# EasyEDA schematic 1-Schematic_Self-balancing robot V2.0.json
TITLE: New Schematic; REV: 1.0; Date: 2018-07-19; Sheet: 1/1; Drawn By: TheShowiest7
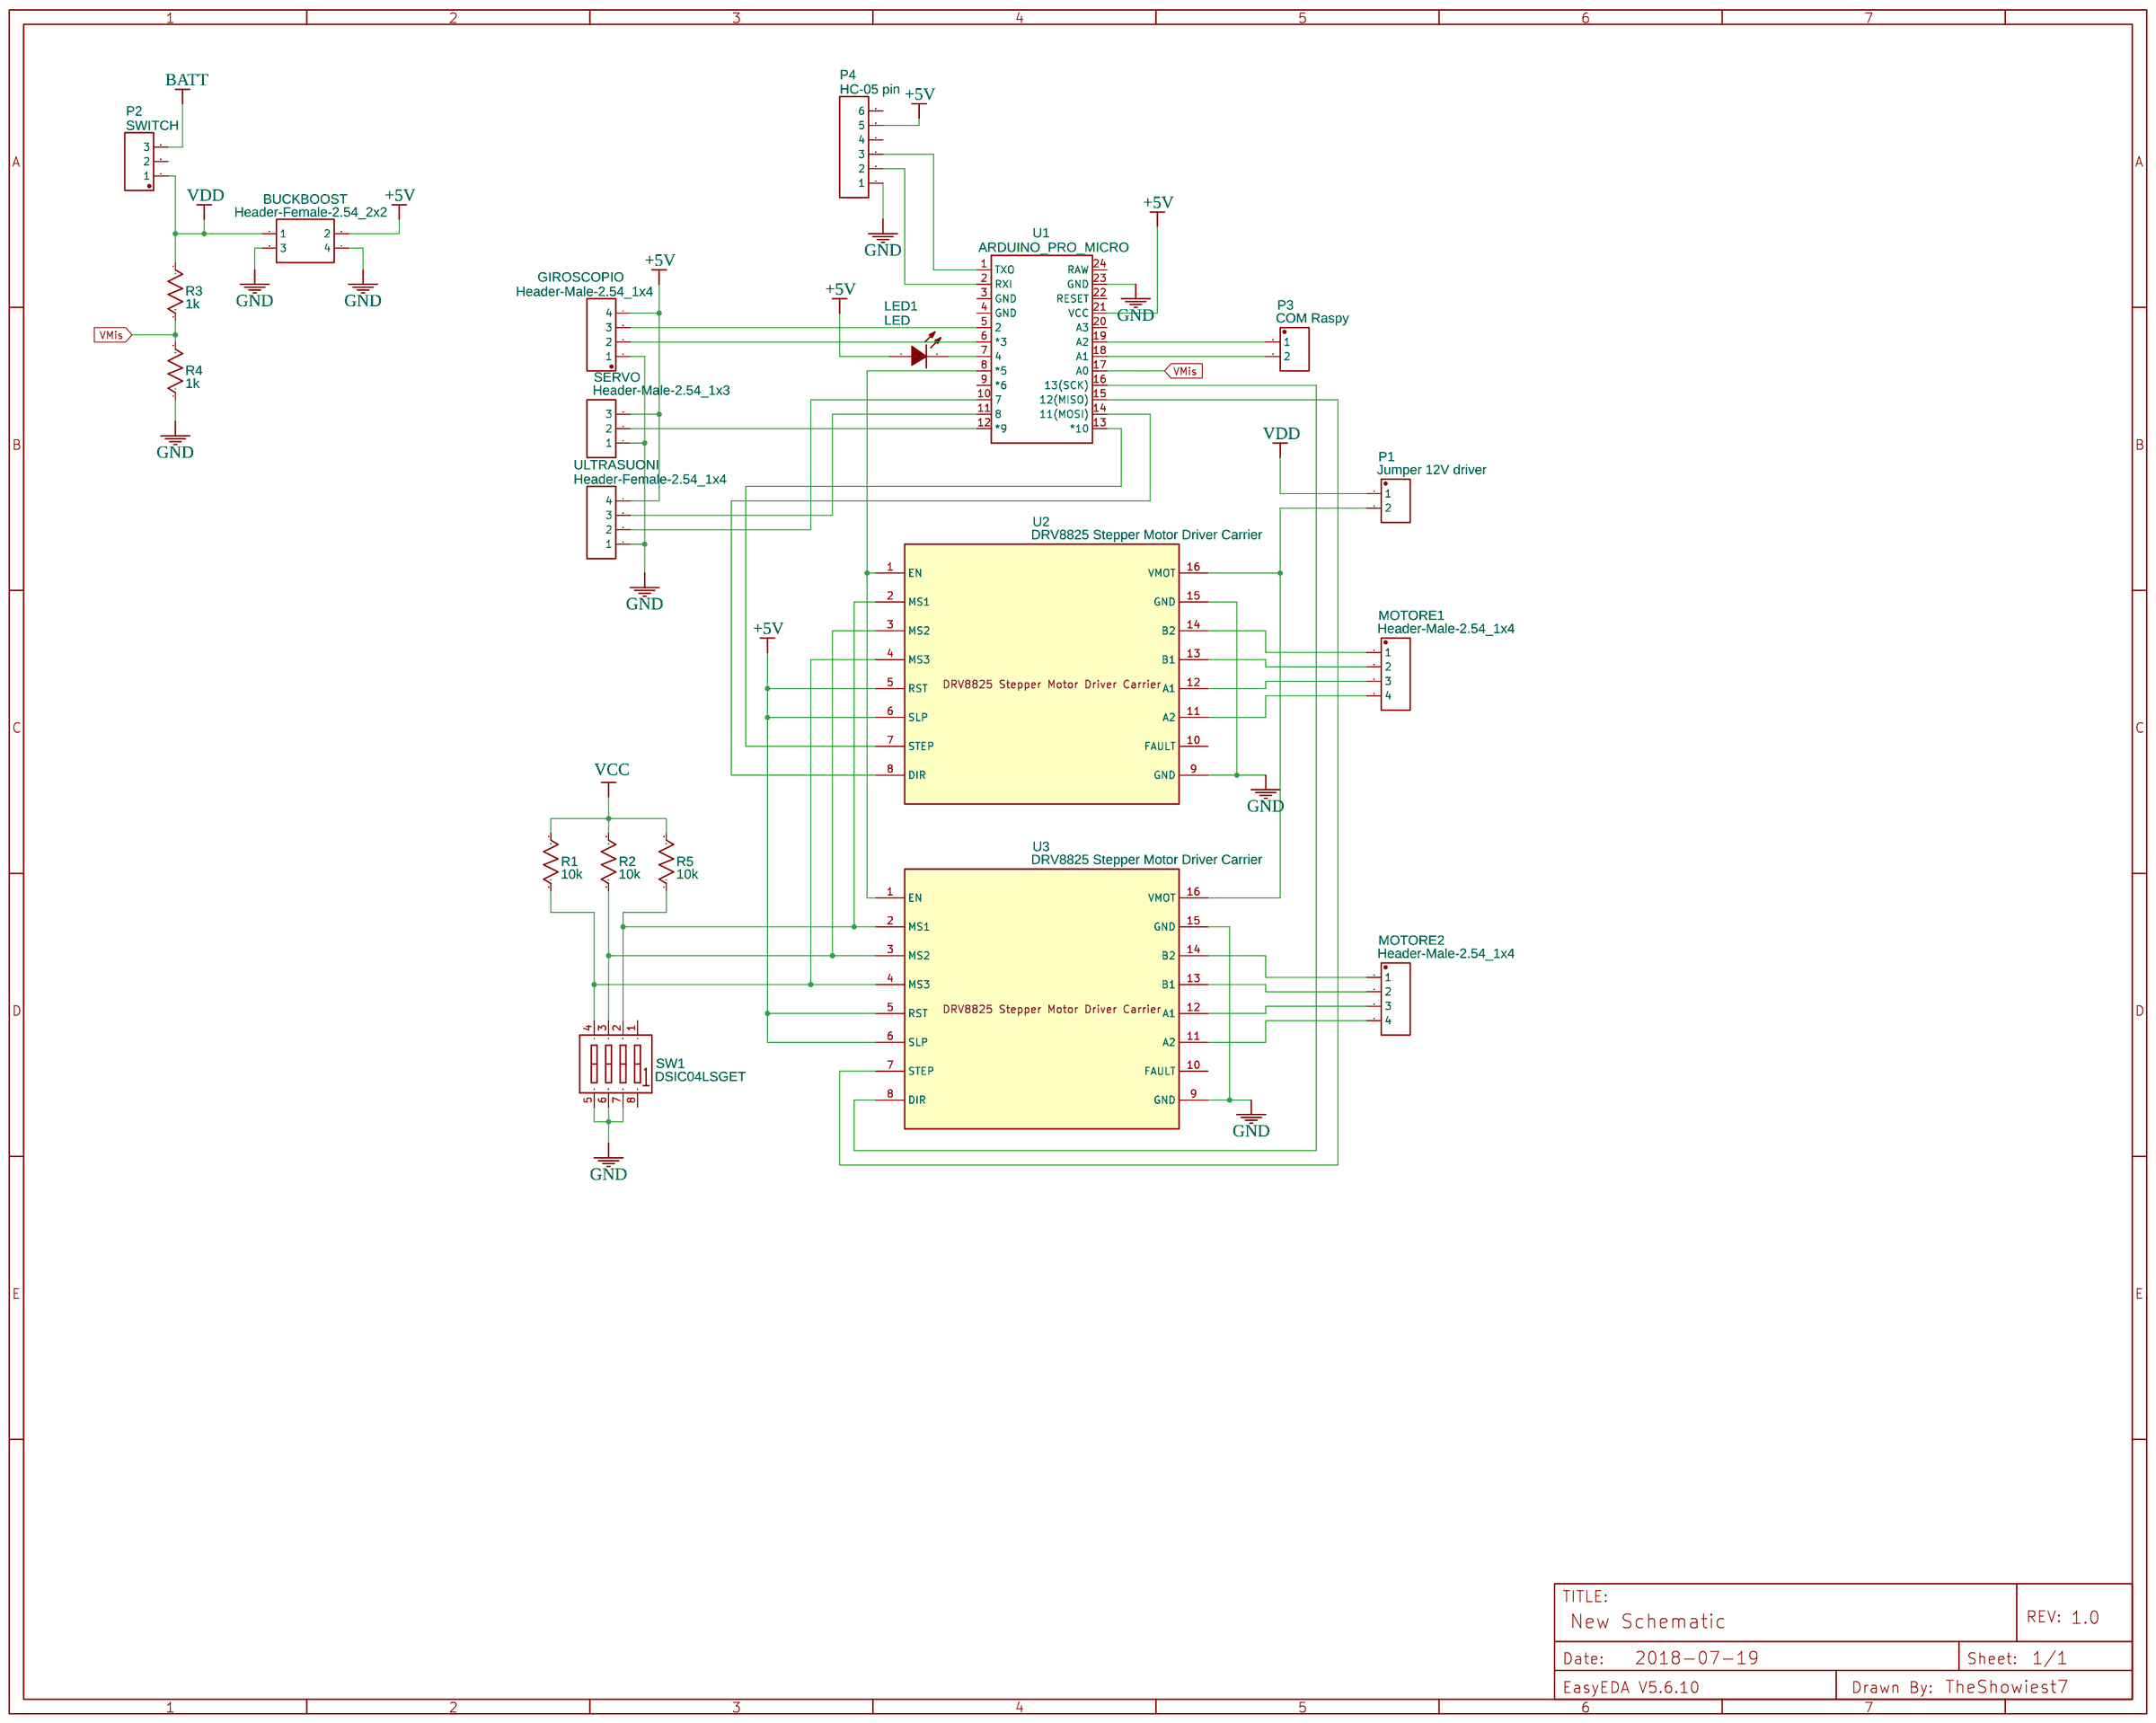
[diagram p0: schematic sheet]

## Parts
BUCKBOOST  Header-Female-2.54_2x2  [HDR-2X2/2.54]
GIROSCOPIO  Header-Male-2.54_1x4  [DIP-1X4P-2.54MM-M]
LED1  LED  [LED-3MM]
MOTORE1  Header-Male-2.54_1x4  [DIP-1X4P-2.54MM-M]
MOTORE2  Header-Male-2.54_1x4  [DIP-1X4P-2.54MM-M]
P1  Jumper 12V driver  [WJ2EDGVC-5.08-2P]
P2  SWITCH  [WJ2EDGVC-5.08-3P]
P3  COM Raspy  [WJ2EDGVC-5.08-2P]
P4  HC-05 pin  [HDR-6X1/2.54]
R1  10k  [AXIAL-0.3]
R2  10k  [AXIAL-0.3]
R3  1k  [AXIAL-0.3]
R4  1k  [AXIAL-0.3]
R5  10k  [AXIAL-0.3]
SERVO  Header-Male-2.54_1x3  [HDR-3X1/2.54]
SW1  DSIC04LSGET  [SWITCH-KE-4BIT/2.54_SMD]
U1  ARDUINO_PRO_MICRO  [ARDUINO_PRO_MICRO]
U2  DRV8825 Stepper Motor Driver Carrier  [DRV8825 STEPPER MOTOR DRIVER CARRIER]
U3  DRV8825 Stepper Motor Driver Carrier  [DRV8825 STEPPER MOTOR DRIVER CARRIER]
ULTRASUONI  Header-Female-2.54_1x4  [HDR-4X1/2.54]

## Library data of the parts
BUCKBOOST = -: Supplier: LCSC; Manufacturer: BOOMELE; Manufacturer Part: Double Rows2.54mm2*2pHeaders  Pins; Supplier Part: C66690
GIROSCOPIO MOTORE1 MOTORE2 = -: Supplier: LCSC; Manufacturer: Ckmtw; Manufacturer Part: 210S-1*4P L=11.6MMGold-plated black; Contributor: LCSC; Supplier Part: C124378
LED1 = -: Supplier: LCSC; Manufacturer: KENTO; Manufacturer Part: LEDOrange orange 3AO4UD; image: //image.lceda.cn/szlcsc/C62095.jpg; Supplier Part: C62095
P1 P3 = -: Supplier: LCSC; Manufacturer: ReliaPro; image: //image.lceda.cn/szlcsc/C8445.jpg; Supplier Part: C8445
P2 = -: Supplier: LCSC; Manufacturer: ReliaPro; image: //image.lceda.cn/szlcsc/C8430.jpg; Supplier Part: C8430
P4 = -: Supplier: LCSC; Manufacturer: BOOMELE; Manufacturer Part: Female header 1*6p; Supplier Part: C40877
R1-R5 = Res_AXIAL-0.3(1/8W)_US: Manufacturer Part: ?
SERVO = -: Supplier: LCSC; Manufacturer: BOOMELE; Manufacturer Part: Header2.54mm 1*3P; image: //image.lceda.cn/szlcsc/C49257.jpg; Supplier Part: C49257
SW1 = -: Supplier: LCSC; Manufacturer: KE; image: //image.lceda.cn/szlcsc/C54950.jpg; Supplier Part: C54950
U1 = -: Contributor: SparkFun; Manufacturer Part: ?
U2 U3 = -: Contributor: winter2015; sourceId: YsmgyP7pj; Manufacturer Part: ?
ULTRASUONI = -: Supplier: LCSC; Manufacturer: ReliaPro; Supplier Part: C124413

## Nets
+5V: BUCKBOOST.2 GIROSCOPIO.4 LED1.1(A) P4.5 SERVO.3 U1.21(VCC) U2.5(RST) U2.6(SLP) U3.5(RST) U3.6(SLP) ULTRASUONI.4
GND: BUCKBOOST.3 BUCKBOOST.4 GIROSCOPIO.1 P4.1 R4.1 SERVO.1 SW1.5(B4) SW1.6(B3) SW1.7(B2) U1.23(GND) U2.9(GND) U2.15(GND) U3.9(GND) U3.15(GND) ULTRASUONI.1
VCC: R1.1 R2.1 R5.2
VDD: BUCKBOOST.1 P1.1 P2.1 R3.1
BATT: P2.3
VMis: R3.2 R4.2 U1.17(A0)
Net-(GIROSCOPIO-2): GIROSCOPIO.2 U1.6(*3)
Net-(GIROSCOPIO-3): GIROSCOPIO.3 U1.5(2)
Net-(LED1-2): LED1.2(K) U1.7(4)
Net-(MOTORE1-1): MOTORE1.1 U2.14(B2)
Net-(MOTORE1-2): MOTORE1.2 U2.13(B1)
Net-(MOTORE1-3): MOTORE1.3 U2.12(A1)
Net-(MOTORE1-4): MOTORE1.4 U2.11(A2)
Net-(MOTORE2-1): MOTORE2.1 U3.14(B2)
Net-(MOTORE2-2): MOTORE2.2 U3.13(B1)
Net-(MOTORE2-3): MOTORE2.3 U3.12(A1)
Net-(MOTORE2-4): MOTORE2.4 U3.11(A2)
Net-(P1-2): P1.2 U2.16(VMOT) U3.16(VMOT)
Net-(P3-1): P3.1 U1.19(A2)
Net-(P3-2): P3.2 U1.18(A1)
Net-(P4-2): P4.2 U1.2(RXI)
Net-(P4-3): P4.3 U1.1(TXO)
Net-(R1-2): R1.2 SW1.4(A4) U2.4(MS3) U3.4(MS3)
Net-(R2-2): R2.2 SW1.3(A3) U2.3(MS2) U3.3(MS2)
Net-(R5-1): R5.1 SW1.2(A2) U2.2(MS1) U3.2(MS1)
Net-(SERVO-2): SERVO.2 U1.12(*9)
Net-(U1-8): U1.8(*5) U2.1(EN) U3.1(EN)
Net-(U1-10): U1.10(7) ULTRASUONI.2
Net-(U1-11): U1.11(8) ULTRASUONI.3
Net-(U1-13): U1.13(*10) U2.7(STEP)
Net-(U1-14): U1.14(11(MOSI)) U2.8(DIR)
Net-(U1-15): U1.15(12(MISO)) U3.7(STEP)
Net-(U1-16): U1.16(13(SCK)) U3.8(DIR)

Not connected (* = marked no-connect by the designer): P2 2; P4 4 6; SW1 1(A1) 8(B1); U1 3(GND) 4(GND) 9(*6) 20(A3) 22(RESET) 24(RAW); U2 10(FAULT); U3 10(FAULT)
